# EAGLE design timer (EAGLE 9.3.0)
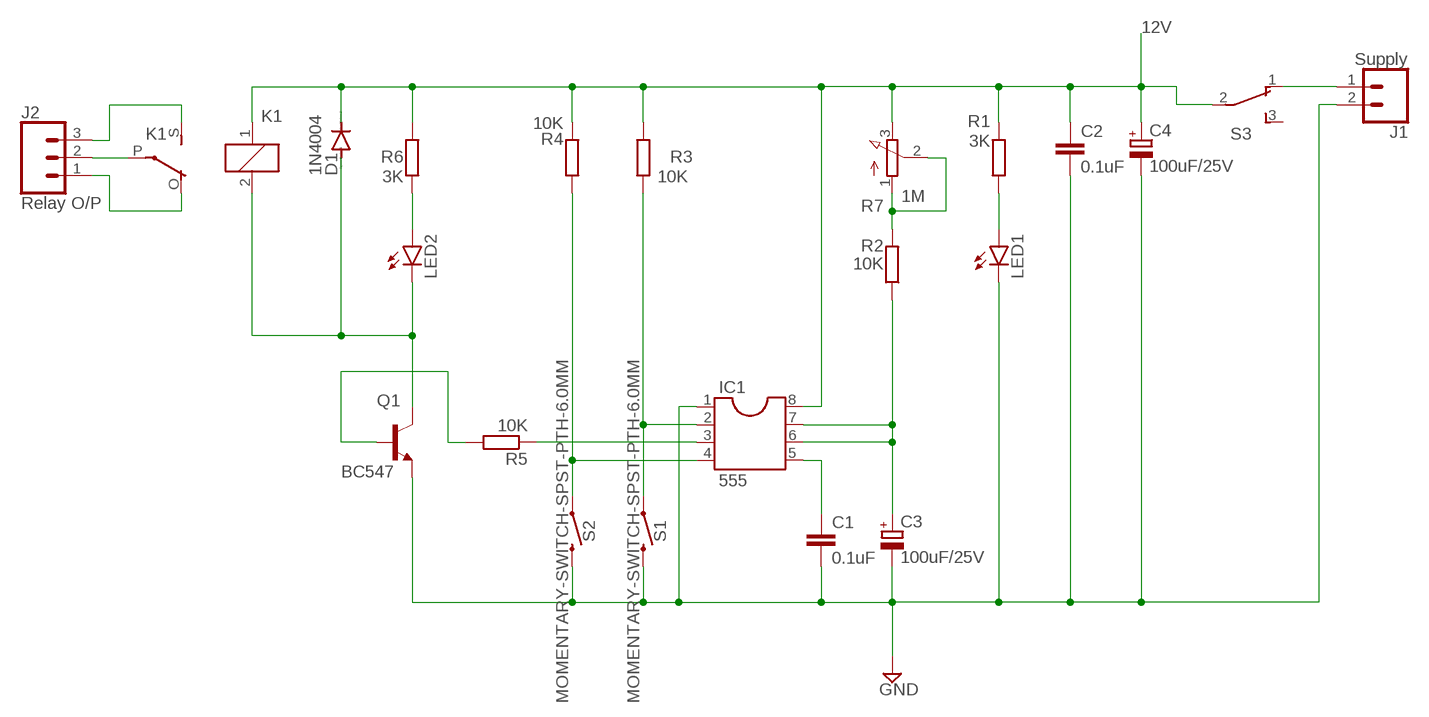
[diagram p0: schematic, sheet 1]

## Parts
C1  0.1uF  C-EU025-050X050  [C025-050X050]
C2  0.1uF  C-EU025-050X050  [C025-050X050]
C3  100uF/25V  CPOL-EUE2.5-6  [E2,5-6]
C4  100uF/25V  CPOL-EUE2.5-6  [E2,5-6]
D1  1N4004  [DO41-10]
IC1  555  DIL8S  [SOCKET-08]
J1  Supply  CONN_025MM  [SCREWTERMINAL-5MM-2]
J2  Relay O/P  CONN_03-SCREW-5MM  [SCREWTERMINAL-5MM-3]
K1  ZF112  [ZF112]
LED1  LED5MM  [LED5MM]
LED2  LED5MM  [LED5MM]
Q1  BC547  [TO92]
R1  3K  R-EU_0207/10  [0207/10]
R2  10K  R-EU_0207/10  [0207/10]
R3  10K  R-EU_0207/10  [0207/10]
R4  10K  R-EU_0207/10  [0207/10]
R5  10K  R-EU_0207/10  [0207/10]
R6  3K  R-EU_0207/10  [0207/10]
R7  1M  3RP/1610N  [3RP/1610N]
S1  MOMENTARY-SWITCH-SPST-PTH-6.0MM  [TACTILE_SWITCH_PTH_6.0MM]
S2  MOMENTARY-SWITCH-SPST-PTH-6.0MM  [TACTILE_SWITCH_PTH_6.0MM]
S3  TL36YO  [TL3XYO]

## Nets
12V: C2.1 C4.+ D1.C IC1.8 K1.1 R1.2 R3.2 R4.2 R6.2 R7.3(E) S3.2(P)
GND: C1.2 C2.2 C3.- C4.- IC1.1 J1.2 LED1.K(C) Q1.1(E) S1.3 S2.3
N$1: C3.+ IC1.6 IC1.7 R2.1
N$2: R2.2 R7.1(A) R7.2(S)
N$3: C1.1 IC1.5
N$6: IC1.4 R4.1 S2.1
N$7: IC1.2 R3.1 S1.1
N$8: IC1.3 R5.1
N$9: Q1.2(B) R5.2
N$10: D1.A K1.2 LED2.K(C) Q1.3(C)
N$11: J2.2 K1.P(2:P)
N$12: LED2.A R6.1
N$13: J1.1 S3.1(O)
N$14: J2.3 K1.S(2:S)
N$15: J2.1 K1.O(2:O)
N$17: LED1.A R1.1
Unconnected: S3.3(S)

## Library data of the parts
C1 C2 = resistor:C-EU: CAPACITOR, European symbol
C3 C4 = resistor:CPOL-EU: POLARIZED CAPACITOR, European symbol
D1 = diode:1N4004: DIODE general purpose rectifier, 1 A
IC1 = ic-package:DIL8: Dual In Line / Socket
J1 = SparkFun-Connectors:CONN_02: Multi connection point. Often used as Generic Header-pin footprint for 0.1 inch spaced/style header connections On any of the 0.1 inch spaced packages, you can populate with these: Break Away Headers - Straight <https://www.sparkfun.com/products/116> (PRT-00116) Break Away Male Headers - Right Angle <https://www.sparkfun.com/products/553> (PRT-00553) Female Headers <https://www.sparkfun.com/products/115> (PRT-00115) Break Away Headers - Machine Pin <https://www.sparkfun.com/products/117> (PRT-00117) Break Away Female Headers - Swiss Machine Pin <https://www.sparkfun.com/products/743> (PRT-00743) For SCREWTERMINALS and SPRING TERMINALS visit here: Screw Terimnals on SparkFun.com <https://www.sparkfun.com/search/results?term=Screw+Terminals> (5mm/3.5mm/2.54mm spacing) This device is also useful as a general connection point to wire up your design to another part of your project. Our various solder wires solder well into these plated through hole pads. Hook-Up Wire - Assortment (Stranded, 22 AWG) <https://www.sparkfun.com/products/11375> (PRT-11375) Hook-Up Wire - Assortment (Solid Core, 22 AWG) <https://www.sparkfun.com/products/11367> (PRT-11367) View the entire wire category on our website here <https://www.sparkfun.com/categories/141> Special notes: Molex polarized connector foot print use with: PRT-08233 with associated crimp pins and housings. 2.54_SCREWTERM for use with PRT-10571. 3.5mm Screw Terminal footprints for PRT-08084 5mm Screw Terminal footprints for use with PRT-08432; SF_SKU: PRT-08432
J2 = SparkFun-Connectors:CONN_03: Multi connection point. Often used as Generic Header-pin footprint for 0.1 inch spaced/style header connections On any of the 0.1 inch spaced packages, you can populate with these: Break Away Headers - Straight <https://www.sparkfun.com/products/116> (PRT-00116) Break Away Male Headers - Right Angle <https://www.sparkfun.com/products/553> (PRT-00553) Female Headers <https://www.sparkfun.com/products/115> (PRT-00115) Break Away Headers - Machine Pin <https://www.sparkfun.com/products/117> (PRT-00117) Break Away Female Headers - Swiss Machine Pin <https://www.sparkfun.com/products/743> (PRT-00743) Stackable Header - 3 Pin (Female, 0.1") <https://www.sparkfun.com/products/13875> (PRT-13875) For SCREWTERMINALS and SPRING TERMINALS visit here: Screw Terimnals on SparkFun.com <https://www.sparkfun.com/search/results?term=Screw+Terminals> (5mm/3.5mm/2.54mm spacing) This device is also useful as a general connection point to wire up your design to another part of your project. Our various solder wires solder well into these plated through hole pads. Hook-Up Wire - Assortment (Stranded, 22 AWG) <https://www.sparkfun.com/products/11375> (PRT-11375) Hook-Up Wire - Assortment (Solid Core, 22 AWG) <https://www.sparkfun.com/products/11367> (PRT-11367) View the entire wire category on our website here <https://www.sparkfun.com/categories/141> Special notes: Molex polarized connector foot print use with SKU : PRT-08232 with associated crimp pins and housings.; PROD_ID: CONN-10134; SF_SKU: PRT-08433
K1 = relay:ZF112: RELAY 1 x switch; OC_FARNELL: unknown; OC_NEWARK: unknown
LED1 LED2 = led:LED: LED OSRAM: - CHIPLED LG R971, LG N971, LY N971, LG Q971, LY Q971, LO R971, LY R971 LH N974, LH R974 LS Q976, LO Q976, LY Q976 LO Q996 - Hyper CHIPLED LW Q18S LB Q993, LB Q99A, LB R99A - SideLED LS A670, LO A670, LY A670, LG A670, LP A670 LB A673, LV A673, LT A673, LW A673 LH A674 LY A675 LS A676, LA A676, LO A676, LY A676, LW A676 LS A679, LY A679, LG A679 - Hyper Micro SIDELED® LS Y876, LA Y876, LO Y876, LY Y876 LT Y87S - SmartLED LW L88C, LW L88S LB L89C, LB L89S, LG L890 LS L89K, LO L89K, LY L89K LS L896, LA L896, LO L896, LY L896 - TOPLED LS T670, LO T670, LY T670, LG T670, LP T670 LSG T670, LSP T670, LSY T670, LOP T670, LYG T670 LG T671, LOG T671, LSG T671 LB T673, LV T673, LT T673, LW T673 LH T674 LS T676, LA T676, LO T676, LY T676, LB T676, LH T676, LSB T676, LW T676 LB T67C, LV T67C, LT T67C, LS T67K, LO T67K, LY T67K, LW E67C LS E67B, LA E67B, LO E67B, LY E67B, LB E67C, LV E67C, LT E67C LW T67C LS T679, LY T679, LG T679 LS T770, LO T770, LY T770, LG T770, LP T770 LB T773, LV T773, LT T773, LW T773 LH T774 LS E675, LA E675, LY E675, LS T675 LS T776, LA T776, LO T776, LY T776, LB T776 LHGB T686 LT T68C, LB T68C - Hyper Mini TOPLED® LB M676 - Mini TOPLED Santana® LG M470 LS M47K, LO M47K, LY M47K Source: http://www.osram.convergy.de LUXEON: - LUMILED® LXK2-PW12-R00, LXK2-PW12-S00, LXK2-PW14-U00, LXK2-PW14-V00 LXK2-PM12-R00, LXK2-PM12-S00, LXK2-PM14-U00 LXK2-PE12-Q00, LXK2-PE12-R00, LXK2-PE12-S00, LXK2-PE14-T00, LXK2-PE14-U00 LXK2-PB12-K00, LXK2-PB12-L00, LXK2-PB12-M00, LXK2-PB14-N00, LXK2-PB14-P00, LXK2-PB14-Q00 LXK2-PR12-L00, LXK2-PR12-M00, LXK2-PR14-Q00, LXK2-PR14-R00 LXK2-PD12-Q00, LXK2-PD12-R00, LXK2-PD12-S00 LXK2-PH12-R00, LXK2-PH12-S00 LXK2-PL12-P00, LXK2-PL12-Q00, LXK2-PL12-R00 Source: www.luxeon.com KINGBRIGHT: KA-3528ASYC Source: www.kingbright.com
Q1 = transistor-npn:BC547*: NPN Transistor
R1-R6 = resistor:R-EU_: RESISTOR, European symbol
R7 = pot:3RP/1610N: 16mm Potentiometer one level Source: http://www.alphapotentiometers.net/html/16mm_pot_2.html
S1 S2 = SparkFun-Switches:MOMENTARY-SWITCH-SPST: Momentary Switch (Pushbutton) - SPST Normally-open (NO) SPST momentary switches (buttons, pushbuttons). Variants PTH-12MM - 12mm square, through-hole Momentary Pushbutton Switch - 12mm Square <https://www.sparkfun.com/products/9190> (COM-09190) PTH-6.0MM, PTH-6.0MM-KIT - 6.0mm square, through-hole Mini Pushbutton Switch <https://www.sparkfun.com/products/97> (COM-00097) KIT package intended for soldering kit's - only one side of pads' copper is exposed. PTH-RIGHT-ANGLE-KIT - Right-angle, through-hole Right Angle Tactile Button <https://www.sparkfun.com/products/10791> - Used on SparkFun BigTime Watch Kit <https://www.sparkfun.com/products/11734> SMD-12MM - 12mm square, surface-mount Tactile Button - SMD (12mm) <https://www.sparkfun.com/products/12993> (COM-12993) Used on SparkFun PicoBoard <https://www.sparkfun.com/products/11888> SMD-4.5MM - 4.5mm Square Trackball Switch Used on SparkFun Blackberry Trackballer Breakout <https://www.sparkfun.com/products/13169> SMD-4.6MMX2.8MM - 4.60mm x 2.80mm, surface mount Used on SparkFun SAMD21 Mini Breakout <https://www.sparkfun.com/products/13664> SMD-5.2MM, SMD-5.2-REDUNDANT - 5.2mm square, surface-mount Mini Pushbutton Switch - SMD <https://www.sparkfun.com/products/8720> (COM-08720) Used on Arduino Pro Mini <https://www.sparkfun.com/products/11114> REDUNDANT package connects both switch circuits together SMD-6.0X3.5MM - 6.0 x 3.5mm, surface mount Momentary Reset Switch SMD <https://www.sparkfun.com/products/8229> (COM-08229) SMD-6.2MM-TALL - 6.2mm square, surface mount Tactile Button - SMD (6mm) <https://www.sparkfun.com/products/12992> Used on SparkFun Digital Sandbox <https://www.sparkfun.com/products/12651> SMD-RIGHT-ANGLE - Right-angle, surface mount Used on SparkFun Block for Intel® Edison - Arduino <https://www.sparkfun.com/products/13036>; PROD_ID: SWCH-08441; SF_SKU: COM-00097
S3 = switch:TL36YO: TINY SWITCH ON - ON Source: http://www2.produktinfo.conrad.com/datenblaetter/700000-724999/705152-da-01-de-Subminiaturschalter_TL_36YO.pdf

## Board
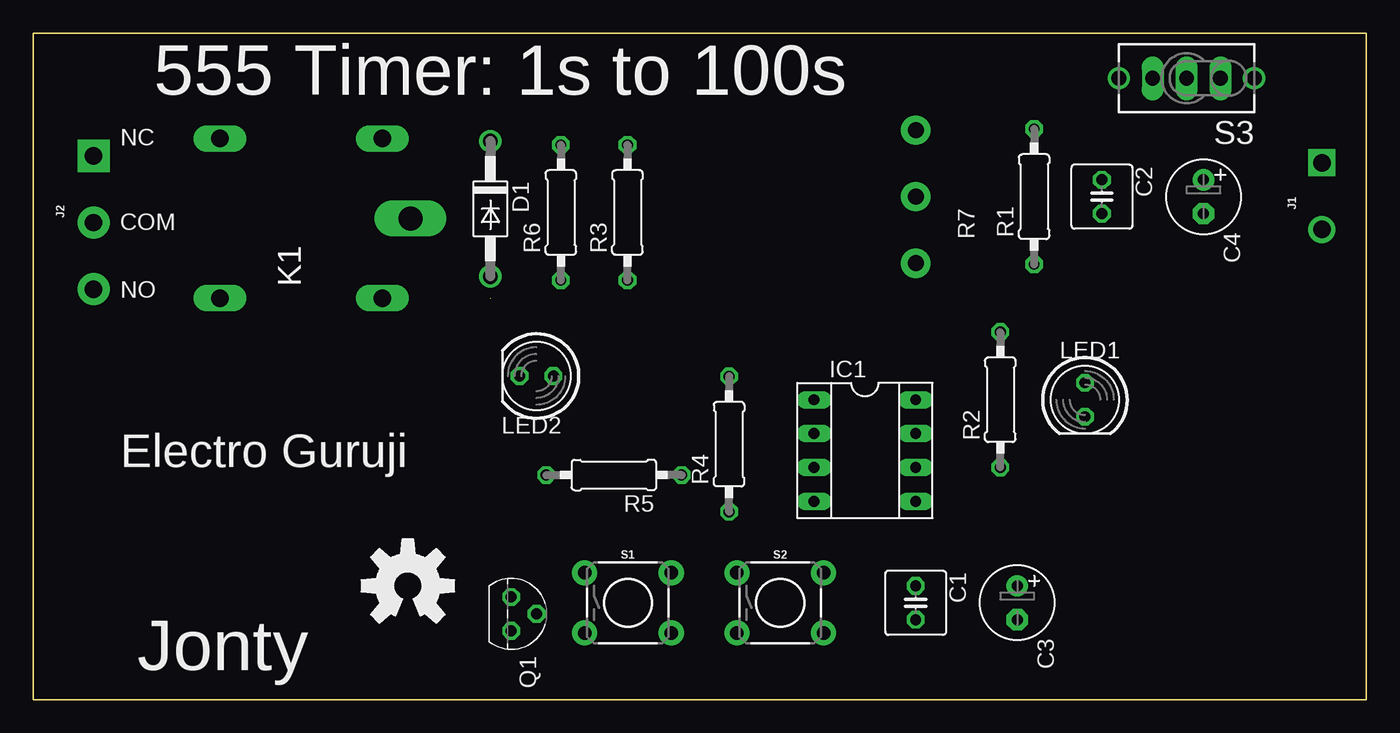
[diagram p1: board, top side]
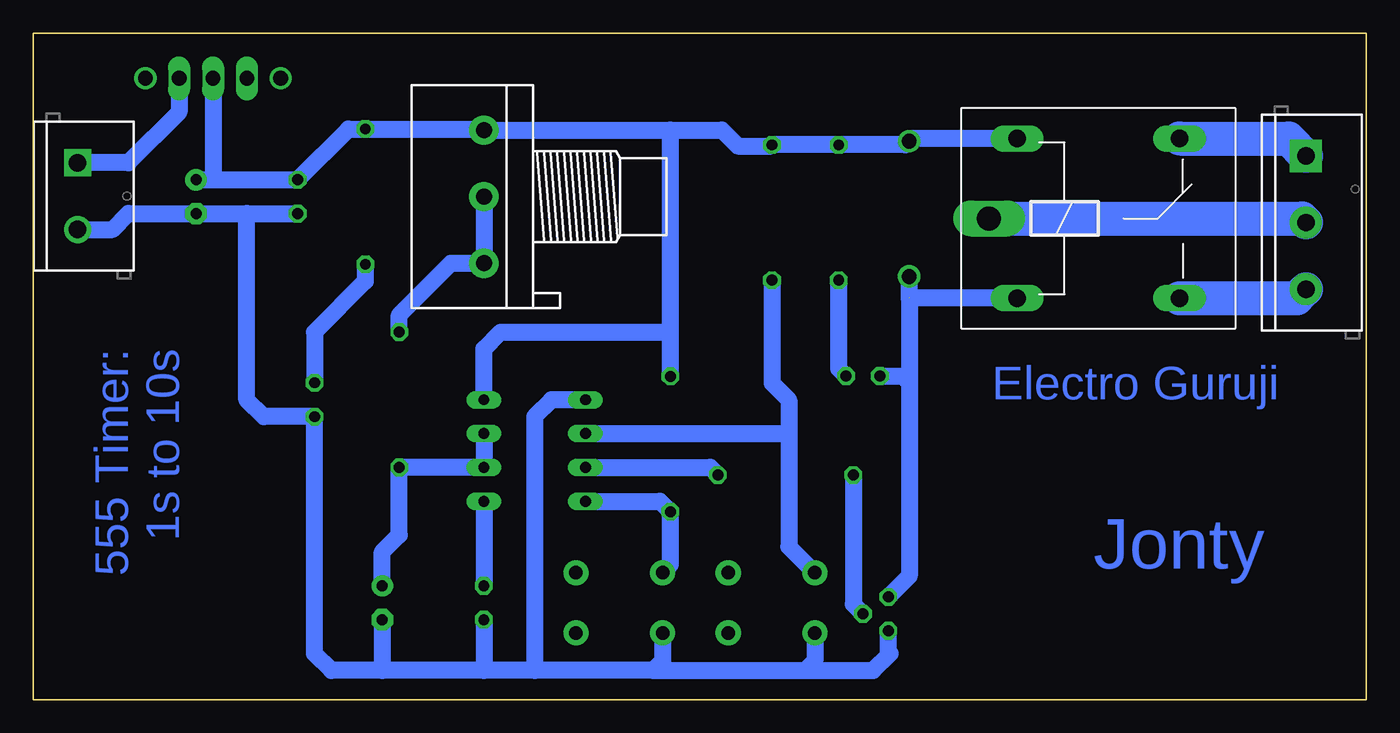
[diagram p2: board, bottom side, seen from below]

Size 100 x 50 mm. Coordinates in mm from the lower left corner, seen from the top.
Outline: 0,50 100,50 100,0 0,0 0,50
Copper layers (1*16): Top 0.035mm / dielectric 1.5mm / Bottom 0.035mm
Design rules "default": minimum track width 6mil, minimum drill 0.35mm, track to track 6mil, track to pad 6mil, pad to pad 6mil, via to via 6mil, smd to smd 6mil, copper to edge 40mil, drill to drill 6mil, minimum pad ring 10mil, minimum via ring 8mil, stop-mask expansion 4mil, vias tented up to drill 0mil, thermal gap 10mil

### Footprints (pad centres in the part's own frame; a part is rotated, then mirrored left to right if it is on the bottom)
C025-050X050 = drill 0.813 octagon: 1 -1.27,0; 2 1.27,0
E2,5-6 = drill 0.813 pad 1.6: + -1.27,0 | drill 0.813 pad 1.6 octagon: - 1.27,0
DO41-10 = drill 1.118: A 5.08,0; C -5.08,0
SOCKET-08 = drill 0.813 long: 1 -3.81,-3.81; 2 -1.27,-3.81; 3 1.27,-3.81; 4 3.81,-3.81; 5 3.81,3.81; 6 1.27,3.81; 7 -1.27,3.81; 8 -3.81,3.81
SCREWTERMINAL-5MM-2 = drill 1.3 pad 2.032 square: 1 0,0 | drill 1.3 pad 2.032: 2 5,0
SCREWTERMINAL-5MM-3 = drill 1.3 pad 2.413 square: 1 0,0 | drill 1.3 pad 2.413: 2 5,0; 3 10,0
ZF112 = drill 1.321 long: 1 -6.096,5.994; 2 -6.096,-5.994; O 6.096,5.994; S 6.096,-5.994 | drill 1.803 long: P -8.204,0
LED5MM = drill 0.813 octagon: A -1.27,0; K 1.27,0
TO92 = drill 0.813 octagon: 1 1.27,0; 2 0,1.905; 3 -1.27,0
0207/10 = drill 0.813 octagon: 1 -5.08,0; 2 5.08,0
3RP/1610N = drill 1.2 pad 2.184: 1 -5,0; 2 0,0; 3 5,0
TACTILE_SWITCH_PTH_6.0MM = drill 1.016 pad 1.88: 1 -3.251,2.261; 2 3.251,2.261; 3 -3.251,-2.261; 4 3.251,-2.261
TL3XYO = drill 1.1 pad 1.422 long: 1 -2.54,0; 2 0,0; 3 2.54,0 | drill 1.1 pad 1.676: M1 -5.08,0; M2 5.08,0

### Placement (x,y rotation side)
C1  66.2,7.26 270 top
C2  80.17,37.74 270 top
C3  73.82,7.26 270 top
C4  87.79,37.74 270 top
D1  34.29,36.83 270 top
IC1  62.39,18.69 270 top
J1  96.68,40.28 270 bottom
J2  4.52,40.8 270 bottom
K1  20.09,36.11 0 bottom
LED1  78.9,22.5 270 top
LED2  37.75,24.28 180 top
Q1  35.85,6.43 270 top
R1  75.09,37.74 90 top
R2  72.55,22.5 90 top
R3  44.58,36.55 90 top
R4  52.2,19.17 90 top
R5  43.56,16.85 180 top
R6  39.58,36.55 90 top
R7  66.2,37.74 90 bottom
S1  44.61,7.26 0 top
S2  56.04,7.26 0 top
S3  86.52,46.63 180 top
U$1  [OSHW-LOGO-L]  28.1,8.53 0 top

### Tracks (layer width: path | path; a pad name or v marks a point on that pad's centre or on a via)
12V
  Bottom 1.27: K1.1 34.1,42.1 D1.C 34.57,41.63 R6.2 R3.2 44.66,41.55 47.15,41.55 48.34,42.74 52.23,42.74 | C4.+ 86.52,39.01 | 86.52,39.01 C2.1 76.36,42.82 R1.2 66.28,42.82 R7.3 52.23,42.74 | S3.2 86.52,39.01 | R4.2 52.2,27.58 | 52.2,27.58 52.2,42.71 52.23,42.74 | IC1.8 66.2,26.31 64.93,27.58 52.2,27.58
GND
  Bottom 1.27: J1.2 94.06,35.28 92.87,36.47 C4.- 83.98,36.47 | 83.98,36.47 C2.2 | 83.98,36.47 83.98,22.5 82.71,21.23 LED1.K 78.9,3.45 77.63,2.18 73.82,2.18 | IC1.1 61.12,22.5 62.39,21.23 62.39,2.18 | 53.5,2.18 62.39,2.18 | 62.39,2.18 66.2,2.18 | 66.2,2.18 73.82,2.18 | C3.- 73.82,2.18 | C1.2 66.2,2.18 | S2.3 52.79,2.89 53.5,2.18 | Q1.1 35.85,3.58 35.72,3.45 36.99,2.18 42.07,2.18 | 53.5,2.18 42.07,2.18 | S1.3 41.36,2.89 42.07,2.18
N$1
  Bottom 1.27: IC1.7 IC1.6 R2.1 72.55,12.34 73.82,11.07 C3.+
N$2
  Bottom 1.27: R2.2 72.55,28.85 68.66,32.74 R7.1 R7.2
N$3
  Bottom 1.27: IC1.5 C1.1
N$6
  Bottom 1.27: IC1.4 52.99,14.88 R4.1 52.2,10.11 S2.1
N$7
  Bottom 1.27: S1.1 43.31,11.47 43.31,19.96 | IC1.2 43.31,19.96 | R3.1 44.58,23.74 43.31,22.47 43.31,19.96
N$8
  Bottom 1.27: R5.1 49.21,17.42 IC1.3
N$9
  Bottom 1.27: R5.2 38.48,7.16 Q1.2
N$10  (1 unrouted)
  Bottom 1.27: D1.A 34.29,30.12 | K1.2 34.29,30.12 34.29,23.77 | 34.29,23.77 34.29,9.26 Q1.3 | LED2.K 34.8,24.28 34.29,23.77
N$11
  Bottom 2.54: K1.P 4.83,36.11 J2.2
N$12
  Bottom 1.27: R6.1 39.58,24.84 LED2.A
N$13
  Bottom 1.27: S3.1 89.06,44.09 92.87,40.28 J1.1
N$14
  Bottom 2.54: K1.S 5.2,30.12 J2.3
N$15
  Bottom 2.54: K1.O 5.82,42.1 J2.1
N$17
  Bottom 1.27: R1.1 75.09,31.39 78.9,27.58 LED1.A

### Text on the board
Bottom: 555 Timer: / 1s to 10s | Electro Guruji | Jonty
tPlace: 555 Timer: 1s to 100s | NC | COM | NO | Electro Guruji | Jonty